# EAGLE design shifter (EAGLE 7.1.0)
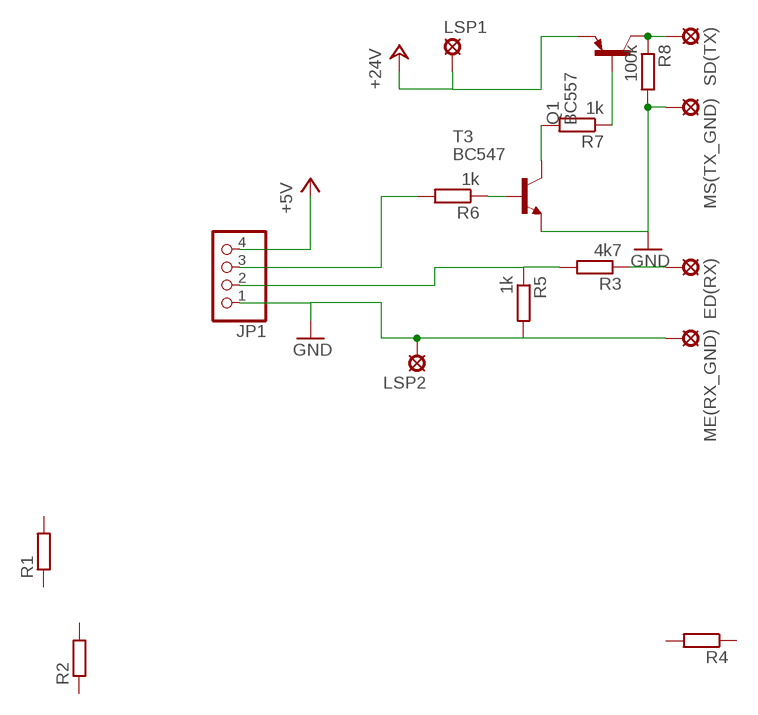
[diagram p0: schematic, sheet 1]

## Parts
ED(RX)  LSP10  [LSP10]
JP1  PINHD-1X4  [1X04]
LSP1  LSP10  [LSP10]
LSP2  LSP10  [LSP10]
ME(RX_GND)  LSP10  [LSP10]
MS(TX_GND)  LSP10  [LSP10]
Q1  BC557  [TO92]
R1  R-EU_M0805  [M0805]
R2  R-EU_M0805  [M0805]
R3  4k7  R-EU_M0805  [M0805]
R4  R-EU_M0805  [M0805]
R5  1k  R-EU_M0805  [M0805]
R6  1k  R-EU_M0805  [M0805]
R7  1k  R-EU_M0805  [M0805]
R8  100k  R-EU_M0805  [M0805]
SD(TX)  LSP10  [LSP10]
T3  BC547  [TO92]

## Nets
+5V: JP1.4
+24V: LSP1.MP Q1.1(E)
GND: JP1.1 LSP2.MP ME(RX_GND).MP MS(TX_GND).MP R5.2 R8.2 T3.1(E)
N$2: ED(RX).MP R3.1
N$3: JP1.2 R3.2 R5.1
N$4: JP1.3 R6.2
N$5: R6.1 T3.2(B)
N$6: R7.2 T3.3(C)
N$7: Q1.2(B) R7.1
N$8: Q1.3(C) R8.1 SD(TX).MP
Unconnected: R1.1 R1.2 R2.1 R2.2 R4.1 R4.2

## Library data of the parts
ED(RX) LSP1 LSP2 ME(RX_GND) MS(TX_GND) SD(TX) = solpad:LSP10: SOLDER PAD drill 1.0 mm, distributor Buerklin, 12H555
JP1 = pinhead:PINHD-1X4: PIN HEADER
Q1 = transistor-pnp:BC557: PNP Transistor
R1-R8 = rcl:R-EU_: RESISTOR, European symbol
T3 = transistor:BC547: NPN TRANSISTOR

## Board
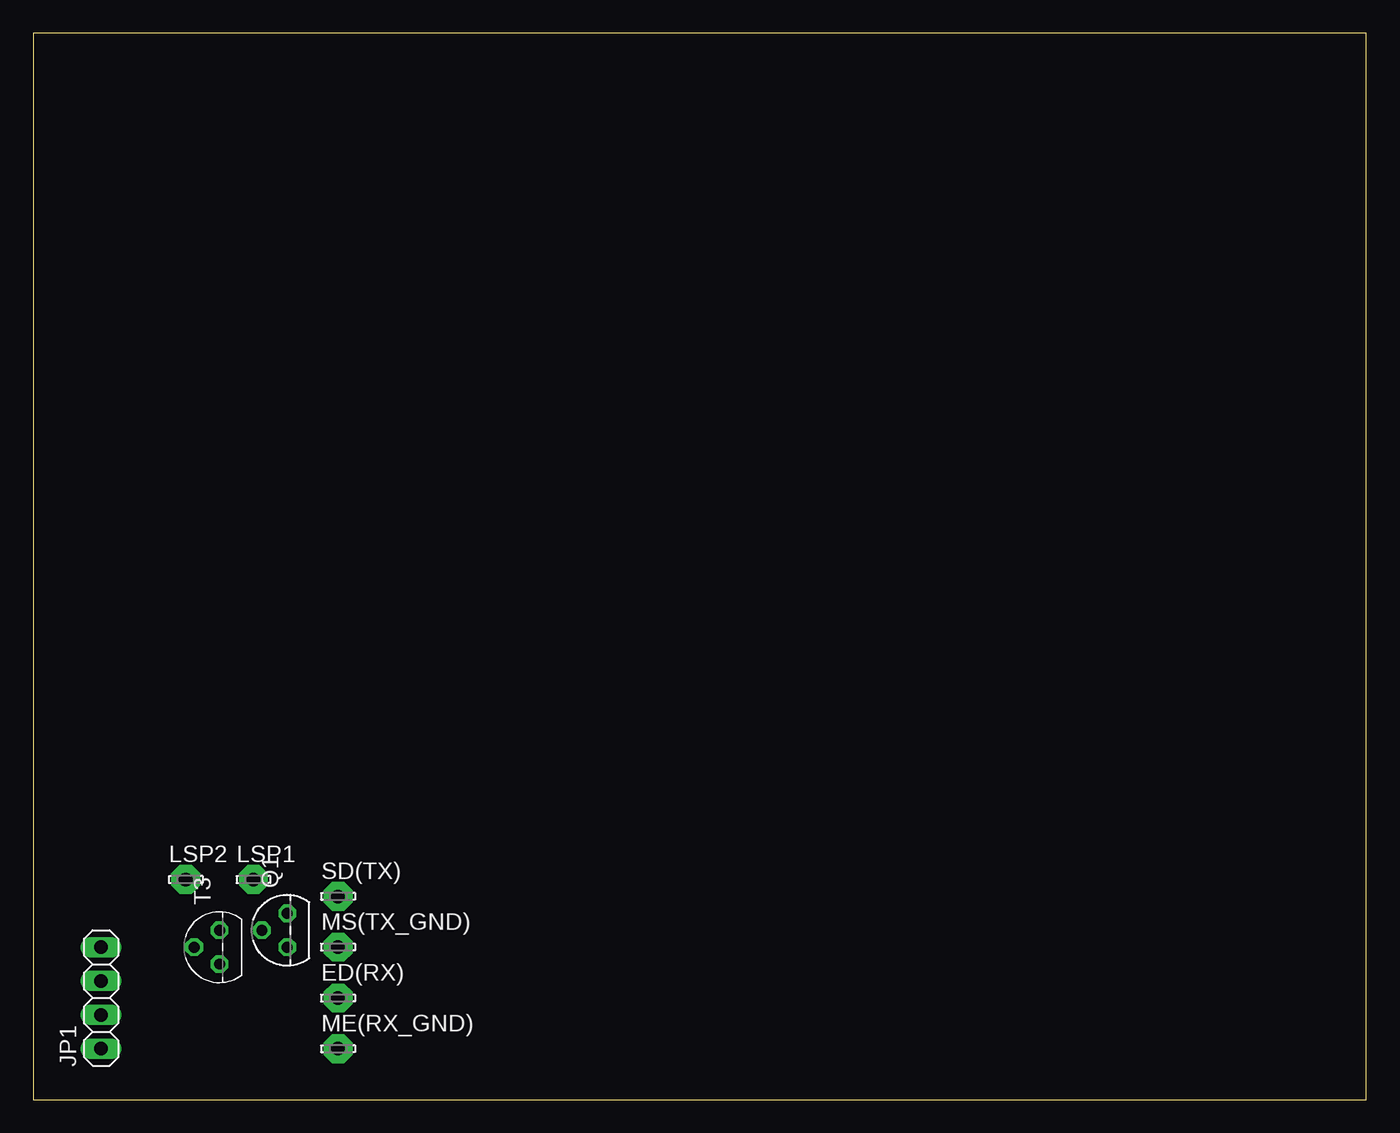
[diagram p1: board, top side]
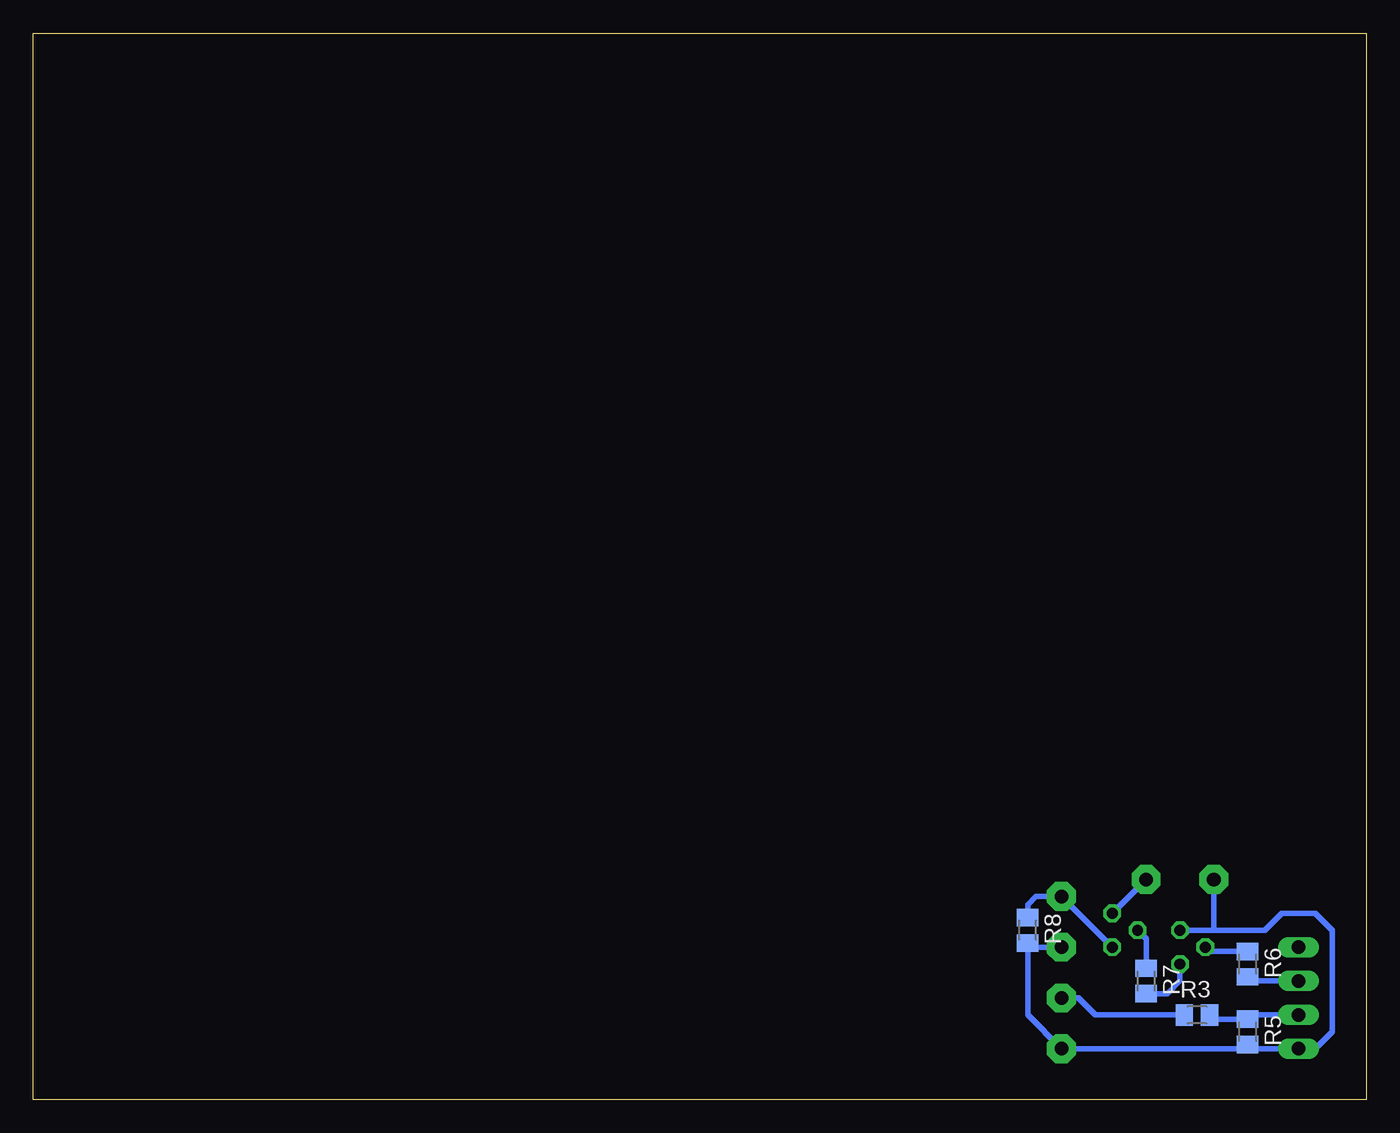
[diagram p2: board, bottom side, seen from below]

Size 100 x 80 mm. Coordinates in mm from the lower left corner, seen from the top.
Outline: 0,0 100,0 100,80 0,80 0,0
Copper layers (1*16): Top 0.035mm / dielectric 1.5mm / Bottom 0.035mm
Design rules "default": minimum track width 10mil, minimum drill 24mil, track to track 8mil, track to pad 8mil, pad to pad 8mil, via to via 8mil, smd to smd 8mil, copper to edge 40mil, drill to drill 8mil, minimum pad ring 10mil, minimum via ring 8mil, stop-mask expansion 4mil, vias tented up to drill 0mil, thermal gap 10mil

### Footprints (pad centres in the part's own frame; a part is rotated, then mirrored left to right if it is on the bottom)
LSP10 = drill 1.016 pad 2.159 octagon: MP 0,0
1X04 = drill 1.016 long: 1 -3.81,0; 2 -1.27,0; 3 1.27,0; 4 3.81,0
TO92 = drill 0.813 octagon: 1 1.27,0; 2 0,1.905; 3 -1.27,0
M0805 = smd 1.3 x 1.6: 1 -0.95,0; 2 0.95,0

### Placement (x,y rotation side)
ED(RX)  22.86,7.62 0 top
JP1  5.08,7.62 90 top
LSP1  16.51,16.51 0 top
LSP2  11.43,16.51 0 top
ME(RX_GND)  22.86,3.81 0 top
MS(TX_GND)  22.86,11.43 0 top
Q1  19.05,12.7 90 top
R1  -29.21,29.21 0 top  (outside the outline)
R2  -34.29,29.21 0 top  (outside the outline)
R3  12.7,6.35 0 bottom
R4  -15.24,34.29 0 top  (outside the outline)
R5  8.89,5.08 270 bottom
R6  8.89,10.16 270 bottom
R7  16.51,8.89 270 bottom
R8  25.4,12.7 270 bottom
SD(TX)  22.86,15.24 0 top
T3  13.97,11.43 90 top

### Tracks (layer width: path | path; a pad name or v marks a point on that pad's centre or on a via)
+24V
  Bottom 0.406: LSP1.MP Q1.1
GND
  Bottom 0.406: T3.1 11.43,12.7 | 11.43,12.7 7.62,12.7 6.35,13.97 3.81,13.97 2.54,12.7 2.54,5.08 3.81,3.81 JP1.1 8.89,3.81 R5.2 9.21,3.81 ME(RX_GND).MP 25.4,6.35 R8.2 25.08,11.43 MS(TX_GND).MP | LSP2.MP 11.43,12.7
N$2
  Bottom 0.406: R3.1 20.32,6.35 21.59,7.62 ED(RX).MP
N$3
  Bottom 0.406: JP1.2 8.89,6.35 R5.1 11.75,6.03 R3.2
N$4
  Bottom 0.406: JP1.3 8.89,8.89 R6.2
N$5
  Bottom 0.406: R6.1 12.06,11.11 T3.2
N$6
  Bottom 0.406: T3.3 13.97,8.89 14.92,7.94 R7.2
N$7
  Bottom 0.406: R7.1 16.51,12.06 Q1.2
N$8
  Bottom 0.406: Q1.3 SD(TX).MP 24.77,15.24 25.4,14.61 R8.1